# EAGLE schematic ENGI301Project2 (EAGLE 8.7.1)
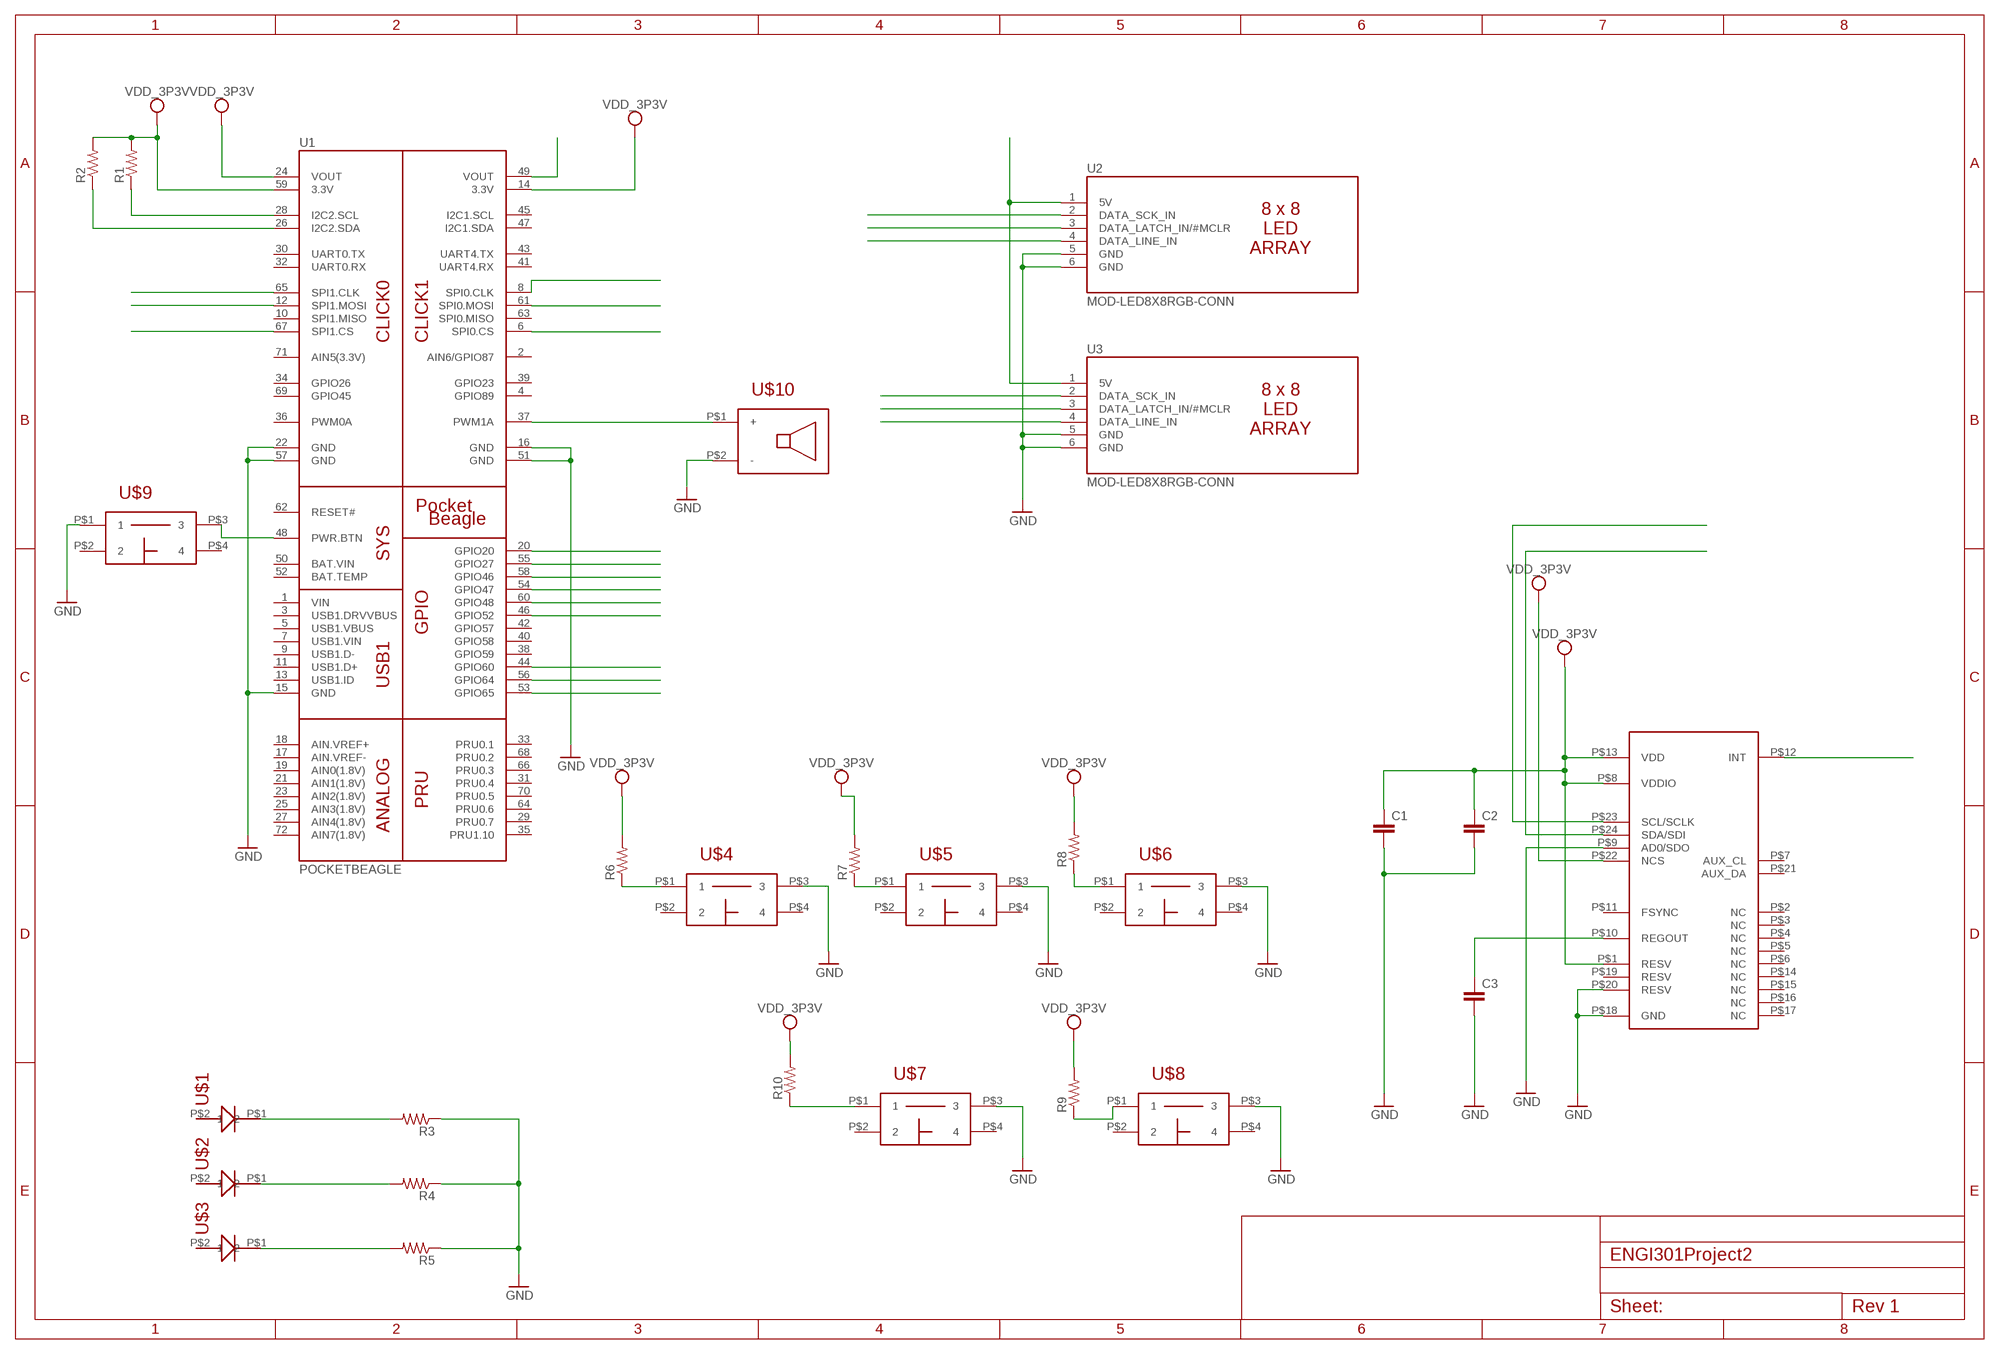
[diagram p0: schematic, sheet 1]

## Parts
C1  C_C0603  [C0603]
C2  C_C0603  [C0603]
C3  C_C0603  [C0603]
R1  R_R0603  [R0603]
R2  R_R0603  [R0603]
R3  R_R0603  [R0603]
R4  R_R0603  [R0603]
R5  R_R0603  [R0603]
R6  R_R0603  [R0603]
R7  R_R0603  [R0603]
R8  R_R0603  [R0603]
R9  R_R0603  [R0603]
R10  R_R0603  [R0603]
U1  POCKETBEAGLE  [POCKETBEAGLE]
U2  MOD-LED8X8RGB-CONN  [FE06W]
U3  MOD-LED8X8RGB-CONN  [FE06W]
U6  MPU-9250  [QFN3]
U$1  LED  [LED]
U$2  LED  [LED]
U$3  LED  [LED]
U$4  BUTTON  [BUTTON]
U$5  BUTTON  [BUTTON]
U$6  BUTTON  [BUTTON]
U$7  BUTTON  [BUTTON]
U$8  BUTTON  [BUTTON]
U$9  BUTTON  [BUTTON]
U$10  BUZZER  [BUZZER]

## Nets
GND: C1.2 C2.2 C3.2 R3.1 R4.1 R5.1 U1.15(GND) U1.16(GND) U1.22(GND) U1.51(GND) U1.57(GND) U2.5(GND) U2.6(GND) U3.5(GND) U3.6(GND) U6.P$9(AD0/SDO) U6.P$18(GND) U6.P$20(RESV) U$4.P$3 U$5.P$3 U$6.P$3 U$7.P$3 U$8.P$3 U$9.P$1 U$10.P$2(-)
N$1: R2.1 U1.26(I2C2.SDA)
N$2: U1.8(SPI0.CLK)
N$3: U1.61(SPI0.MOSI)
N$4: U1.6(SPI0.CS)
N$5: U1.37(PWM1A) U$10.P$1(+)
N$6: R8.1 U$6.P$1
N$7: U1.20(GPIO20)
N$8: U1.55(GPIO27)
N$9: U1.58(GPIO46)
N$10: U1.54(GPIO47)
N$11: U1.60(GPIO48)
N$12: U1.46(GPIO52)
N$13: U1.44(GPIO60)
N$14: U1.56(GPIO64)
N$15: U1.53(GPIO65)
N$16: R1.1 U1.28(I2C2.SCL)
N$17: U1.65(SPI1.CLK)
N$18: U1.12(SPI1.MOSI)
N$19: U1.67(SPI1.CS)
N$20: U1.48(PWR.BTN) U$9.P$3
N$21: U2.1(5V) U3.1(5V)
N$22: U1.49(VOUT)
N$23: R3.2 U$1.P$1
N$24: R4.2 U$2.P$1
N$25: R5.2 U$3.P$1
N$26: R7.1 U$5.P$1
N$27: R6.1 U$4.P$1
N$28: R10.1 U$7.P$1
N$29: U2.2(DATA_SCK_IN)
N$30: R9.1 U$8.P$1
N$31: U2.3(DATA_LATCH_IN/#MCLR)
N$32: C3.1 U6.P$10(REGOUT)
N$33: U2.4(DATA_LINE_IN)
N$35: U3.2(DATA_SCK_IN)
N$36: U6.P$23(SCL/SCLK)
N$37: U6.P$24(SDA/SDI)
N$38: U6.P$12(INT)
N$39: U3.3(DATA_LATCH_IN/#MCLR)
N$40: U3.4(DATA_LINE_IN)
SYS_VDD1_3P3V: C1.1 C2.1 R1.2 R2.2 R6.2 R7.2 R8.2 R9.2 R10.2 U1.14(3.3V) U1.24(VOUT) U1.59(3.3V) U6.P$1(RESV) U6.P$8(VDDIO) U6.P$13(VDD) U6.P$22(NCS) ; supply symbol labelled VDD_3P3V
Unconnected: U1.1(VIN) U1.2(AIN6/GPIO87) U1.3(USB1.DRVVBUS) U1.4(GPIO89) U1.5(USB1.VBUS) U1.7(USB1.VIN) U1.9(USB1.D-) U1.10(SPI1.MISO) U1.11(USB1.D+) U1.13(USB1.ID) U1.17(AIN.VREF-) U1.18(AIN.VREF+) U1.19(AIN0(1.8V)) U1.21(AIN1(1.8V)) U1.23(AIN2(1.8V)) U1.25(AIN3(1.8V)) U1.27(AIN4(1.8V)) U1.29(PRU0.7) U1.30(UART0.TX) U1.31(PRU0.4) U1.32(UART0.RX) U1.33(PRU0.1) U1.34(GPIO26) U1.35(PRU1.10) U1.36(PWM0A) U1.38(GPIO59) U1.39(GPIO23) U1.40(GPIO58) U1.41(UART4.RX) U1.42(GPIO57) U1.43(UART4.TX) U1.45(I2C1.SCL) U1.47(I2C1.SDA) U1.50(BAT.VIN) U1.52(BAT.TEMP) U1.62(RESET#) U1.63(SPI0.MISO) U1.64(PRU0.6) U1.66(PRU0.3) U1.68(PRU0.2) U1.69(GPIO45) U1.70(PRU0.5) U1.71(AIN5(3.3V)) U1.72(AIN7(1.8V)) U6.P$2(NC) U6.P$3(NC) U6.P$4(NC) U6.P$5(NC) U6.P$6(NC) U6.P$7(AUX_CL) U6.P$11(FSYNC) U6.P$14(NC) U6.P$15(NC) U6.P$16(NC) U6.P$17(NC) U6.P$19(RESV) U6.P$21(AUX_DA) U$1.P$2 U$2.P$2 U$3.P$2 U$4.P$2 U$4.P$4 U$5.P$2 U$5.P$4 U$6.P$2 U$6.P$4 U$7.P$2 U$7.P$4 U$8.P$2 U$8.P$4 U$9.P$2 U$9.P$4

## Library data of the parts
C1-C3 = ENGI301 Project 2a:C_: Capacitor SMD. Sizes: 0402, 0603 & 0805
R1-R10 = ENGI301 Project 2a:R_: RESISTOR, American symbol
U1 = ENGI301 Project 2a:POCKETBEAGLE
U2 U3 = ENGI301 Project 2a:MOD-LED8X8RGB-CONN
U6 = ENGI301 Project 2a:MPU-9250
U$1-U$3 = ENGI301 Project 2a:LED
U$4-U$9 = ENGI301 Project 2a:BUTTON
U$10 = ENGI301 Project 2a:BUZZER